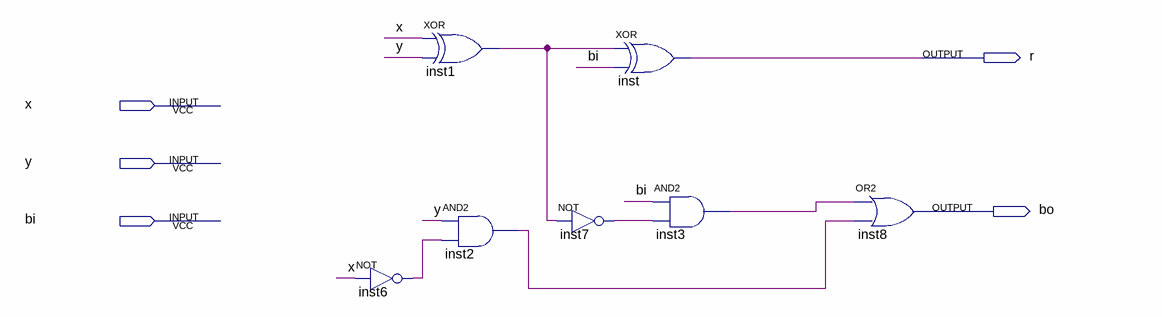
[diagram p0: schematic sheet]
// Quartus schematic subc.bdf as structural Verilog: 7 symbols, 5 pins
module subc (
  input  x,
  input  y,
  input  bi,
  output r,
  output bo
);

  wire inst1_out, inst2_out, inst3_out, inst6_out, inst7_out;

  not inst6 (inst6_out, x);
  xor inst1 (inst1_out, x, y);
  and inst2 (inst2_out, y, inst6_out);
  not inst7 (inst7_out, inst1_out);
  xor inst (r, inst1_out, bi);
  and inst3 (inst3_out, bi, inst7_out);
  or inst8 (bo, inst3_out, inst2_out);
endmodule
